# EAGLE schematic con_brd (EAGLE 9.6.1)
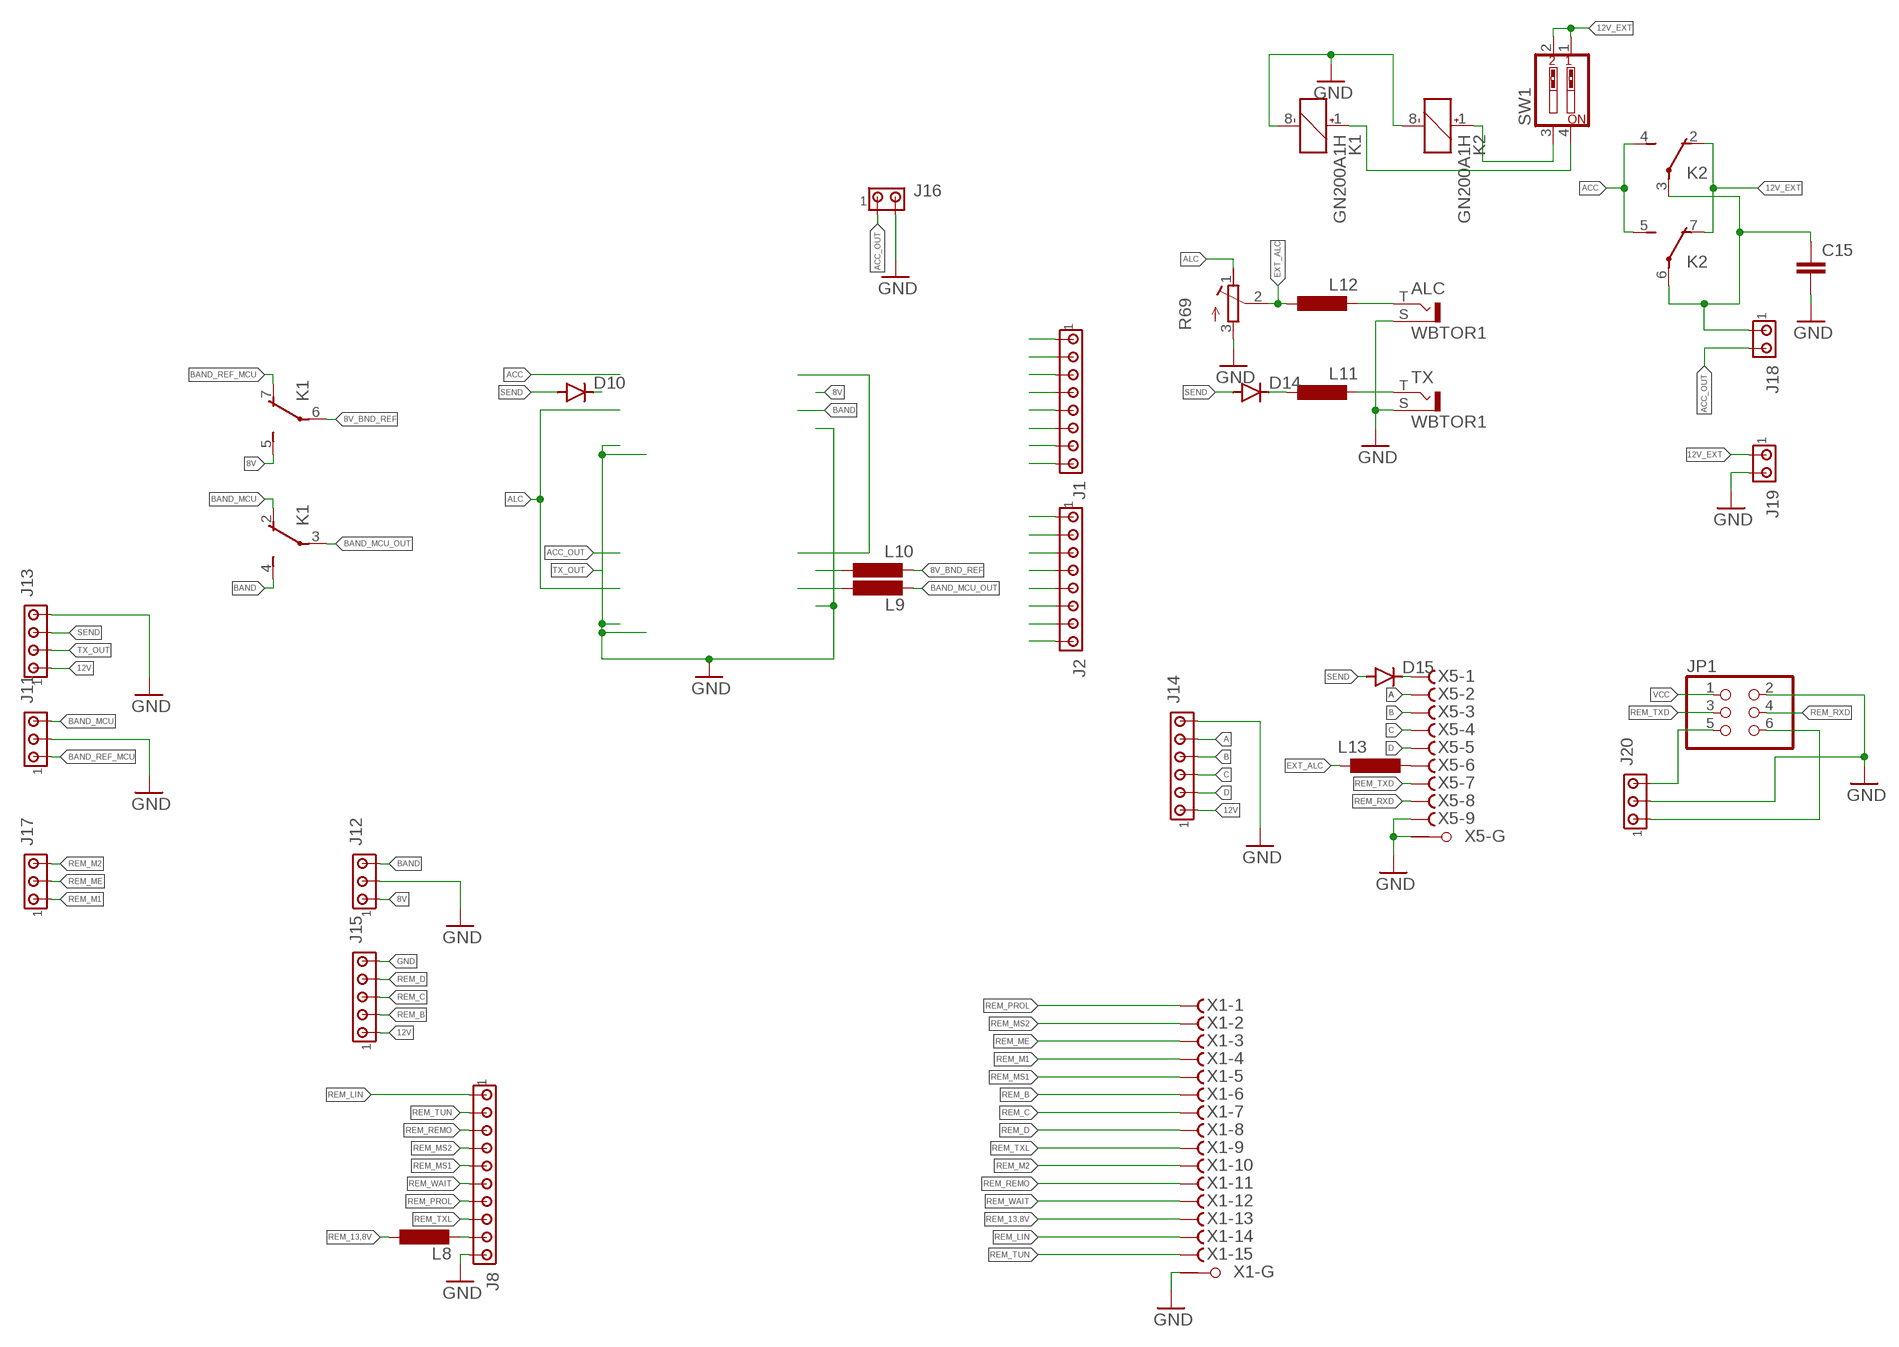
[diagram p0: schematic, sheet 1]

## Parts
ALC  WBTOR1  [WBTOR1]
C15  C-EUC0805K  [C0805K]
D10  DIODE-SOD123  [SOD123]
D14  DIODE-SOD123  [SOD123]
D15  DIODE-SOD123  [SOD123]
J1  MTA08-100  [10X08MTA]
J2  MTA08-100  [10X08MTA]
J8  MTA10-100  [10X10MTA]
J11  MTA03-100  [10X03MTA]
J12  MTA03-100  [10X03MTA]
J13  MTA04-100  [10X04MTA]
J14  MTA06-100  [10X06MTA]
J15  MTA05-100  [10X05MTA]
J16  MTA02-100  [10X02MTA]
J17  MTA03-100  [10X03MTA]
J18  MTA02-100  [10X02MTA]
J19  MTA02-100  [10X02MTA]
J20  MTA03-100  [10X03MTA]
JP1  PINHD-2X3  [2X03]
K1  GN200A1H  [GN-A]
K2  GN200A1H  [GN-A]
L8  L-EUL3230M  [L3230M]
L9  L-EUL2012C  [L2012C]
L10  L-EUL2012C  [L2012C]
L11  L-EUL2012C  [L2012C]
L12  L-EUL2012C  [L2012C]
L13  L-EUL2012C  [L2012C]
R69  R-TRIMM43P  [RTRIM43P]
SW1  SW_DIP-2  [EDG-02]
TX  WBTOR1  [WBTOR1]
X1  F15HPS  [F15HP]
X5  F09HPS  [F09HP]

## Nets
8V: J1.1 J12.1 K1.5(T:S)
8V_BND_REF: K1.6(T:P) L10.2
12V: J13.1 J14.1 J15.1
12V_EXT: J19.1 K2.2(S:O) K2.7(T:O) SW1.1 SW1.2
A: J14.5 X5.2(-2:F)
ACC: J1.7 K2.4(S:S) K2.5(T:S)
ACC_OUT: J2.7 J16.1 J18.2
ALC: J1.5 J2.5 R69.1(E)
B: J14.4 X5.3(-3:F)
BAND: J1.4 J12.3 K1.4(S:S)
BAND_MCU: J11.3 K1.2(S:O)
BAND_MCU_OUT: K1.3(S:P) L9.2
BAND_REF_MCU: J11.1 K1.7(T:O)
C: J14.3 X5.4(-4:F)
D: J14.2 X5.5(-5:F)
EXT_ALC: L12.1 L13.1 R69.2(S)
GND: ALC.S C15.2 J1.2 J1.8 J2.2 J2.8 J8.10 J11.2 J12.2 J13.4 J14.6 J15.5 J16.2 J19.2 J20.2 JP1.2 K1.8(R:-) K2.8(R:-) R69.3(A) TX.S X1.G1(-G:G1) X5.9(-9:F) X5.G1(-G:G1)
N$71: J1.6 J2.6
N$72: J2.4 L9.1
N$75: J2.1 L10.1
N$76: L11.2 TX.T
N$77: ALC.T L12.2
N$79: D10.C J1.3
N$81: D14.C L11.1
N$82: D15.C X5.1(-1:F)
N$84: L13.2 X5.6(-6:F)
N$95: J20.3 JP1.5
N$96: J8.9 L8.2
N$101: K2.1(R:+) SW1.3
N$106: K1.1(R:+) SW1.4
N$111: J20.1 JP1.6
REM_13,8V: L8.1 X1.13(-13:F)
REM_B: J15.2 X1.6(-6:F)
REM_C: J15.3 X1.7(-7:F)
REM_D: J15.4 X1.8(-8:F)
REM_LIN: J8.1 X1.14(-14:F)
REM_M1: J17.1 X1.4(-4:F)
REM_M2: J17.3 X1.10(-10:F)
REM_ME: J17.2 X1.3(-3:F)
REM_MS1: J8.5 X1.5(-5:F)
REM_MS2: J8.4 X1.2(-2:F)
REM_PROL: J8.7 X1.1(-1:F)
REM_REMO: J8.3 X1.11(-11:F)
REM_RXD: JP1.4 X5.8(-8:F)
REM_TUN: J8.2 X1.15(-15:F)
REM_TXD: JP1.3 X5.7(-7:F)
REM_TXL: J8.8 X1.9(-9:F)
REM_WAIT: J8.6 X1.12(-12:F)
SEND: D10.A D14.A D15.A J13.3
TX_OUT: J2.3 J13.2
VCC: C15.1 J18.1 JP1.1 K2.3(S:P) K2.6(T:P)
Unconnected: X1.G2(-G:G2) X5.G2(-G:G2)

## Library data of the parts
ALC TX = con-lumberg:WBTOR1: RCA connectors according to JEITA RC-5231 Cinch RCA-Einbaukupplung nach JEITA RC-5231, abgewinkelte Ausführung Source: http://www.lumberg.de/Produkte/PDFs/WBTOR1.pdf; MPN: WBTOR 1 BLACK; OC_FARNELL: 1200146; OC_NEWARK: 98K2588
C15 = rcl:C-EU: CAPACITOR, European symbol; SPICEPREFIX: C
D10 D14 D15 = diode:DIODE-: DIODE
J1 J2 = con-amp:MTA08-100: AMP connector
J8 = con-amp:MTA10-100: AMP connector
J11 J12 J17 J20 = con-amp:MTA03-100: AMP connector
J13 = con-amp:MTA04-100: AMP connector
J14 = con-amp:MTA06-100: AMP connector Connection corrected 2014-09-19
J15 = con-amp:MTA05-100: AMP connector
J16 J18 J19 = con-amp:MTA02-100: AMP connector
JP1 = pinhead:PINHD-2X3: PIN HEADER
K1 K2 = relay:GN?*: ULTRA-SMALL PACKAGE SLIM POLARIZED RELAY NAiS Source: http://www.mew-europe.com/.. en_ds_61007_0000.pdf; OC_FARNELL: unknown; OC_NEWARK: unknown
L8-L13 = rcl:L-EU: INDUCTOR, European symbol; SPICEPREFIX: L
R69 = rcl:R-TRIMM: Trimm resistor; SPICEMODEL: X; SPICEPREFIXL: POT
SW1 = special:SW_DIP-2: DIP SWITCH
X1 = con-subd:F15HPS: SUB-D; OC_FARNELL: unknown; OC_NEWARK: unknown
X5 = con-subd:F09HPS: SUB-D; OC_FARNELL: unknown; OC_NEWARK: unknown